# EAGLE schematic wemos Atmega 32 sensor tes 2 (EAGLE 9.6.2)
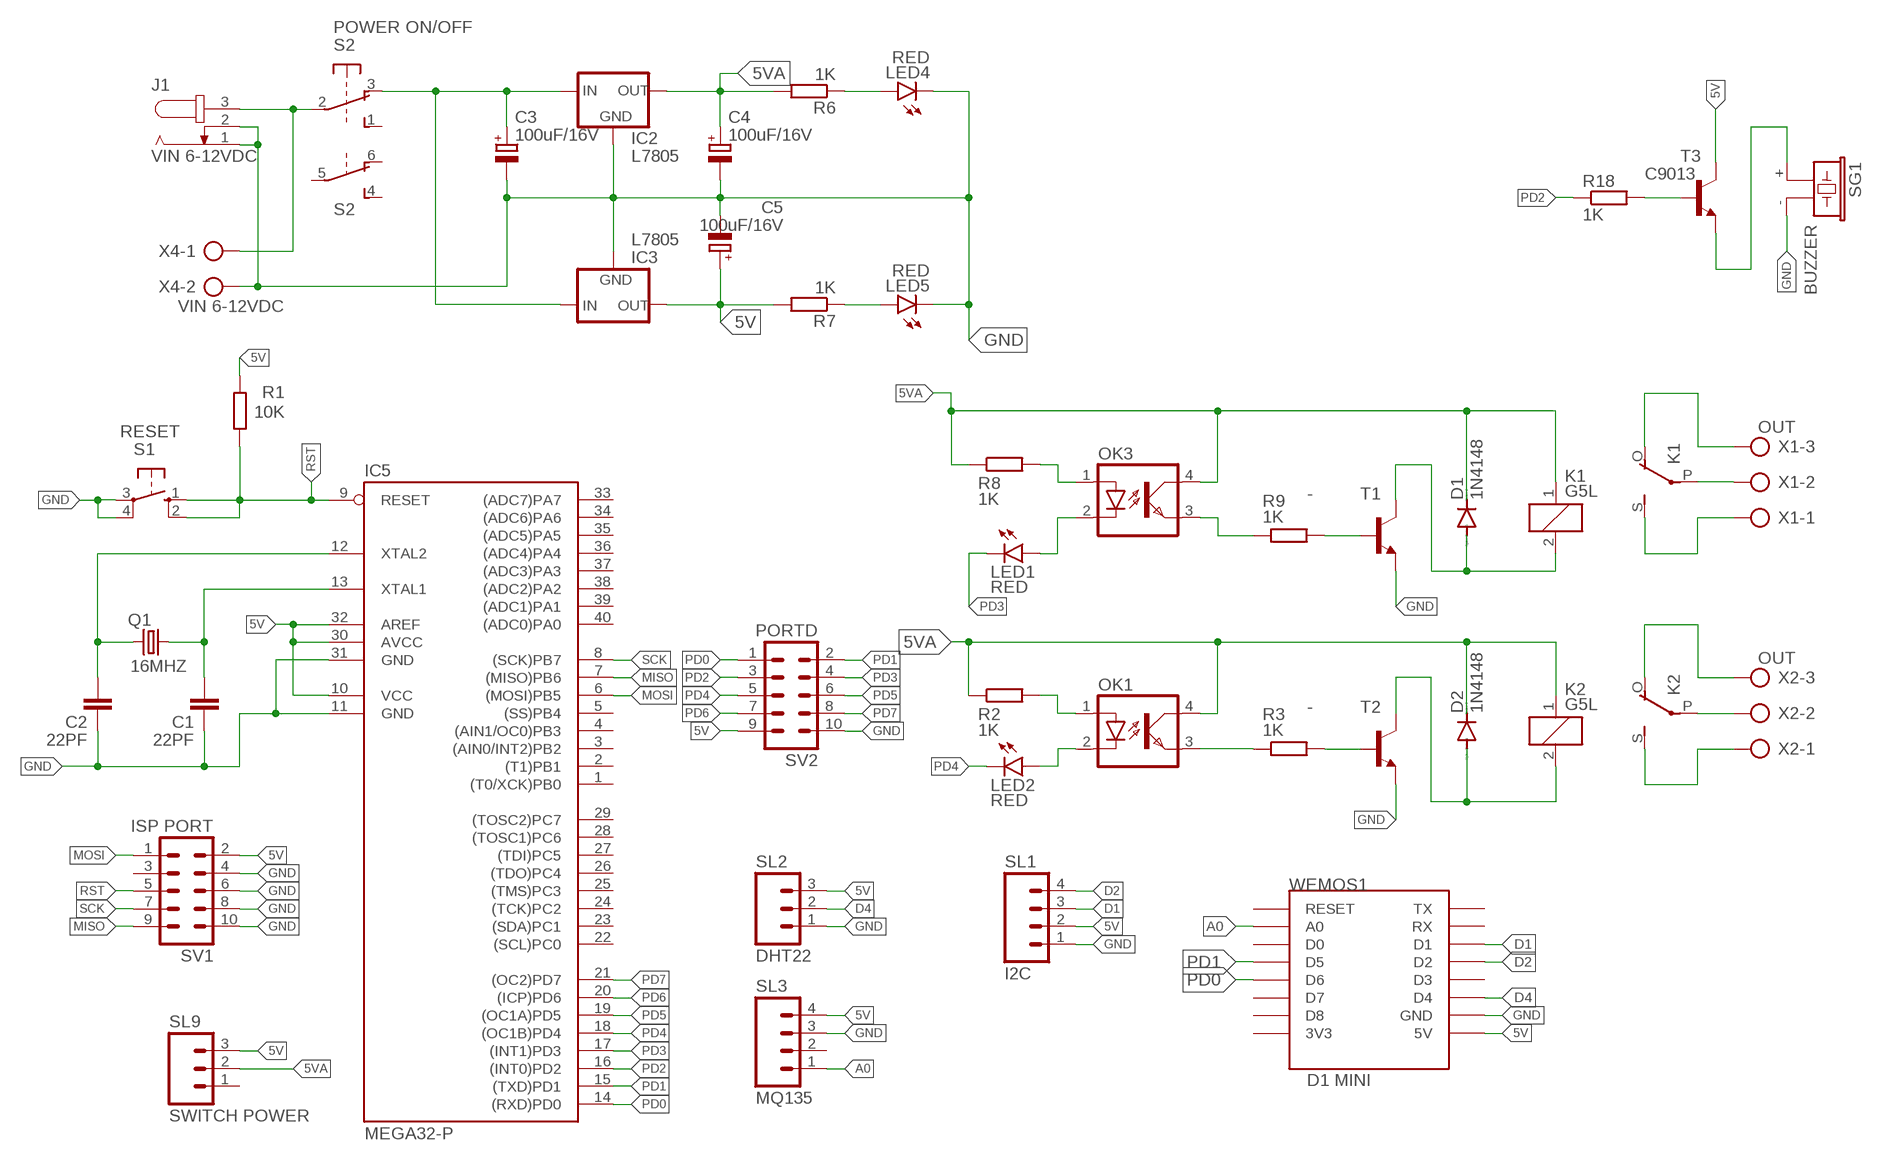
[diagram p0: schematic, sheet 1]

## Parts
C1  22PF  C2.5/2  [C2.5-2]
C2  22PF  C2.5/2  [C2.5-2]
C3  100uF/16V  CPOL-EUE2,5-6E  [E2,5-6E]
C4  100uF/16V  CPOL-EUE2,5-6E  [E2,5-6E]
C5  100uF/16V  CPOL-EUE2,5-6E  [E2,5-6E]
D1  1N4148  DIODE-SOD123  [SOD123]
D2  1N4148  DIODE-SOD123  [SOD123]
IC2  L7805  78XXL  [78XXL]
IC3  L7805  78XXL  [78XXL]
IC5  MEGA32-P  [DIL40]
J1  VIN 6-12VDC  JACK-PLUG1  [SPC4078]
K1  G5L  [G5LE]
K2  G5L  [G5LE]
LED1  RED  LED3MM  [LED3MM]
LED2  RED  LED3MM  [LED3MM]
LED4  RED  LED3MM  [LED3MM]
LED5  RED  LED3MM  [LED3MM]
OK1  PC817  [DIL04]
OK3  PC817  [DIL04]
Q1  16MHZ  CRYSTALHC49S  [HC49/S]
R1  10K  R-EU_R1206  [R1206]
R2  1K  R-EU_R1206  [R1206]
R3  1K  R-EU_R1206  [R1206]
R6  1K  R-EU_R1206  [R1206]
R7  1K  R-EU_R1206  [R1206]
R8  1K  R-EU_R1206  [R1206]
R9  1K  R-EU_R1206  [R1206]
R18  1K  R-EU_R1206  [R1206]
S1  RESET  10-XX  [B3F-10XX]
S2  POWER ON/OFF  9077-2  [9077-2]
SG1  BUZZER  F/CM12P  [F/CM12P]
SL1  I2C  M04  [04P]
SL2  DHT22  M03  [03P]
SL3  MQ135  M04  [04P]
SL9  SWITCH POWER  M03  [03P]
SV1  ISP PORT  ML10  [ML10]
SV2  PORTD  ML10  [ML10]
T1  -  BC808-NPN-SOT23-BEC  [SOT23-BEC]
T2  -  BC808-NPN-SOT23-BEC  [SOT23-BEC]
T3  C9013  BC808-NPN-SOT23-BEC  [SOT23-BEC]
WEMOS1  D1 MINI  WEMOS-D1-MINI  [WEMOS-D1-MINI]
X1  OUT  AK500/3  [AK500/3]
X2  OUT  AK500/3  [AK500/3]
X4  VIN 6-12VDC  AK500/2  [AK500/2]

## Nets
5V: C5.+ IC3.OUT IC5.10(VCC) IC5.30(AVCC) IC5.32(AREF) R1.2 R7.2 SL1.2 SL2.3 SL3.4 SL9.3 SV1.2 SV2.9 T3.C WEMOS1.5V
5VA: C4.+ D1.C D2.C IC2.OUT K1.1 K2.1 OK1.4(COL) OK3.4(COL) R2.1 R6.2 R8.1 SL9.2
A0: SL3.1 WEMOS1.A0
D1: SL1.3 WEMOS1.D1
D2: SL1.4 WEMOS1.D2
D4: SL2.2 WEMOS1.D4
GND: C1.1 C2.1 C3.- C4.- C5.- IC2.GND IC3.GND IC5.11(GND) IC5.31(GND) J1.1 J1.2 LED4.K(C) LED5.K(C) S1.3(P) S1.4(P1) SG1.- SL1.1 SL2.1 SL3.3 SV1.4 SV1.6 SV1.8 SV1.10 SV2.10 T1.E T2.E WEMOS1.GND X4.2
MISO: IC5.7((MISO)PB6) SV1.9
MOSI: IC5.6((MOSI)PB5) SV1.1
N$1: J1.3 S2.2(1:P) X4.1
N$2: C3.+ IC2.IN IC3.IN S2.3(1:O)
N$4: C2.2 IC5.12(XTAL2) Q1.2
N$5: LED4.A R6.1
N$8: LED5.A R7.1
N$10: C1.2 IC5.13(XTAL1) Q1.1
N$11: R18.2 T3.B
N$14: SG1.+ T3.E
N$18: OK3.1(A) R8.2
N$19: LED1.A OK3.2(C)
N$22: OK3.3(EMIT) R9.1
N$23: R9.2 T1.B
N$25: D1.A K1.2 T1.C
N$27: D2.A K2.2 T2.C
N$29: R3.2 T2.B
N$30: OK1.3(EMIT) R3.1
N$31: OK1.1(A) R2.2
N$32: LED2.A OK1.2(C)
N$34: K2.P(2:P) X2.2
N$35: K2.O(2:O) X2.3
N$36: K2.S(2:S) X2.1
N$37: K1.O(2:O) X1.3
N$38: K1.S(2:S) X1.1
N$39: K1.P(2:P) X1.2
PD0: IC5.14((RXD)PD0) SV2.1 WEMOS1.D6
PD1: IC5.15((TXD)PD1) SV2.2 WEMOS1.D5
PD2: IC5.16((INT0)PD2) R18.1 SV2.3
PD3: IC5.17((INT1)PD3) LED1.K(C) SV2.4
PD4: IC5.18((OC1B)PD4) LED2.K(C) SV2.5
PD5: IC5.19((OC1A)PD5) SV2.6
PD6: IC5.20((ICP)PD6) SV2.7
PD7: IC5.21((OC2)PD7) SV2.8
RST: IC5.9(RESET) R1.1 S1.1(S) S1.2(S1) SV1.5
SCK: IC5.8((SCK)PB7) SV1.7
Unconnected: IC5.1((T0/XCK)PB0) IC5.2((T1)PB1) IC5.3((AIN0/INT2)PB2) IC5.4((AIN1/OC0)PB3) IC5.5((SS)PB4) IC5.22((SCL)PC0) IC5.23((SDA)PC1) IC5.24((TCK)PC2) IC5.25((TMS)PC3) IC5.26((TDO)PC4) IC5.27((TDI)PC5) IC5.28((TOSC1)PC6) IC5.29((TOSC2)PC7) IC5.33((ADC7)PA7) IC5.34((ADC6)PA6) IC5.35((ADC5)PA5) IC5.36((ADC4)PA4) IC5.37((ADC3)PA3) IC5.38((ADC2)PA2) IC5.39((ADC1)PA1) IC5.40((ADC0)PA0) S2.1(1:S) S2.4(2:S) S2.5(2:P) S2.6(2:O) SL3.2 SL9.1 SV1.3 WEMOS1.3V3 WEMOS1.D0 WEMOS1.D3 WEMOS1.D7 WEMOS1.D8 WEMOS1.RESET WEMOS1.RX WEMOS1.TX

## Library data of the parts
C1 C2 = capacitor-wima:C: CAPACITOR naming: grid - package width
C3-C5 = rcl:CPOL-EU: POLARIZED CAPACITOR, European symbol; SPICEPREFIX: C
D1 D2 = diode:DIODE-: DIODE
IC2 IC3 = v-reg:78XXL: VOLTAGE REGULATOR
IC5 = atmel:MEGA32-P: MICROCONTROLLER 32 Kbytes FLASH 2 Kbytes SRAM 1 Kbytes EEPROM USART 8-channel 10 bit ADC Source: www.atmel.com .. doc2503.pdf; MPN: ATMEGA32-16PU; OC_FARNELL: 1661729; OC_NEWARK: 51P1794
J1 = con-jack:JACK-PLUG: DC POWER JACK Power Jack, DC, Right Angle, Through Hole, Rated 5A at 16VDC, PC Terminals Distributor: Farnell (www.Farnell.de) Drawing: 84N1161.pdf / 84N1162.pdf Manufacturer: SPC Technology (www.spctechnology.com) Type: SPC4077 / SPC 4078; OC_FARNELL: unknown; OC_NEWARK: unknown
K1 K2 = relay:G5L: RELAY 1 x switch, 10 A/120 V AC, 8 A/30 V ADC, Omron; OC_FARNELL: unknown; OC_NEWARK: unknown
LED1 LED2 LED4 LED5 = led3mm_new:LED: LED OSRAM: - CHIPLED LG R971, LG N971, LY N971, LG Q971, LY Q971, LO R971, LY R971 LH N974, LH R974 LS Q976, LO Q976, LY Q976 LO Q996 - Hyper CHIPLED LW Q18S LB Q993, LB Q99A, LB R99A - SideLED LS A670, LO A670, LY A670, LG A670, LP A670 LB A673, LV A673, LT A673, LW A673 LH A674 LY A675 LS A676, LA A676, LO A676, LY A676, LW A676 LS A679, LY A679, LG A679 - Hyper Micro SIDELED® LS Y876, LA Y876, LO Y876, LY Y876 LT Y87S - SmartLED LW L88C, LW L88S LB L89C, LB L89S, LG L890 LS L89K, LO L89K, LY L89K LS L896, LA L896, LO L896, LY L896 - TOPLED LS T670, LO T670, LY T670, LG T670, LP T670 LSG T670, LSP T670, LSY T670, LOP T670, LYG T670 LG T671, LOG T671, LSG T671 LB T673, LV T673, LT T673, LW T673 LH T674 LS T676, LA T676, LO T676, LY T676, LB T676, LH T676, LSB T676, LW T676 LB T67C, LV T67C, LT T67C, LS T67K, LO T67K, LY T67K, LW E67C LS E67B, LA E67B, LO E67B, LY E67B, LB E67C, LV E67C, LT E67C LW T67C LS T679, LY T679, LG T679 LS T770, LO T770, LY T770, LG T770, LP T770 LB T773, LV T773, LT T773, LW T773 LH T774 LS E675, LA E675, LY E675, LS T675 LS T776, LA T776, LO T776, LY T776, LB T776 LHGB T686 LT T68C, LB T68C - Hyper Mini TOPLED® LB M676 - Mini TOPLED Santana® LG M470 LS M47K, LO M47K, LY M47K Source: http://www.osram.convergy.de LUXEON: - LUMILED® LXK2-PW12-R00, LXK2-PW12-S00, LXK2-PW14-U00, LXK2-PW14-V00 LXK2-PM12-R00, LXK2-PM12-S00, LXK2-PM14-U00 LXK2-PE12-Q00, LXK2-PE12-R00, LXK2-PE12-S00, LXK2-PE14-T00, LXK2-PE14-U00 LXK2-PB12-K00, LXK2-PB12-L00, LXK2-PB12-M00, LXK2-PB14-N00, LXK2-PB14-P00, LXK2-PB14-Q00 LXK2-PR12-L00, LXK2-PR12-M00, LXK2-PR14-Q00, LXK2-PR14-R00 LXK2-PD12-Q00, LXK2-PD12-R00, LXK2-PD12-S00 LXK2-PH12-R00, LXK2-PH12-S00 LXK2-PL12-P00, LXK2-PL12-Q00, LXK2-PL12-R00 Source: www.luxeon.com KINGBRIGHT: KA-3528ASYC Source: www.kingbright.com
OK1 OK3 = optocoupler:PC817: SHARP OPTO COUPLER; MPN: PC817X4J000F; OC_FARNELL: 9707727; OC_NEWARK: 97K7059
Q1 = crystal:CRYSTAL: CRYSTAL; OC_FARNELL: 1667008; OC_NEWARK: unknown
R1-R3 R6-R9 R18 = rcl:R-EU_: RESISTOR, European symbol; SPICEPREFIX: R
S1 = switch-omron:10-XX: OMRON SWITCH; MPN: B3F-1000; OC_FARNELL: 176432; OC_NEWARK: 36M3542
S2 = switch-misc:9077-2: MARQUARDT SWITCH 9077.0200 Distributor: Buerklin <https://www.buerklin.com/default.asp?event=ShowArtikel%2812G2822%29&l=d&jump=ArtNr_12G2822>
SG1 = buzzer:F/CM12P: BUZZER Source: Buerklin; OC_FARNELL: unknown; OC_NEWARK: unknown
SL1 SL3 = con-amp-quick:M04: AMP QUICK CONNECTOR; OC_FARNELL: unknown; OC_NEWARK: unknown
SL2 SL9 = con-amp-quick:M03: AMP QUICK CONNECTOR; OC_FARNELL: unknown; OC_NEWARK: unknown
SV1 SV2 = con-mlnew:ML10: HARTING; OC_FARNELL: unknown; OC_NEWARK: unknown
T1-T3 = transistor:*-NPN-: NPN Transistror BF959 corrected 2008.03.06
WEMOS1 = Eagle Mixed Library:WEMOS-D1-MINI: WeMos.cc D1 mini ESP8266 module
X1 X2 = con-ptr500:AK500/3: CONNECTOR; OC_FARNELL: unknown; OC_NEWARK: unknown
X4 = con-ptr500:AK500/2: CONNECTOR; OC_FARNELL: unknown; OC_NEWARK: unknown